# EasyEDA Pro project 3-phase-bldcdriver.eprj

# Schematic 3-phase-bldcdriver
Create Date: 2024-08-07; Page Name: P1; Project Name: 3-phase-bldcdriver; Schematic Name: 3-phase-bldcdriver; Update Date: 2024-08-07; Company: EasyEDA.com; Drawn: EasyEDA; Page Size: A4; Part Number: JLCPCB-002; Reviewed: EasyEDA; Version: V0.1
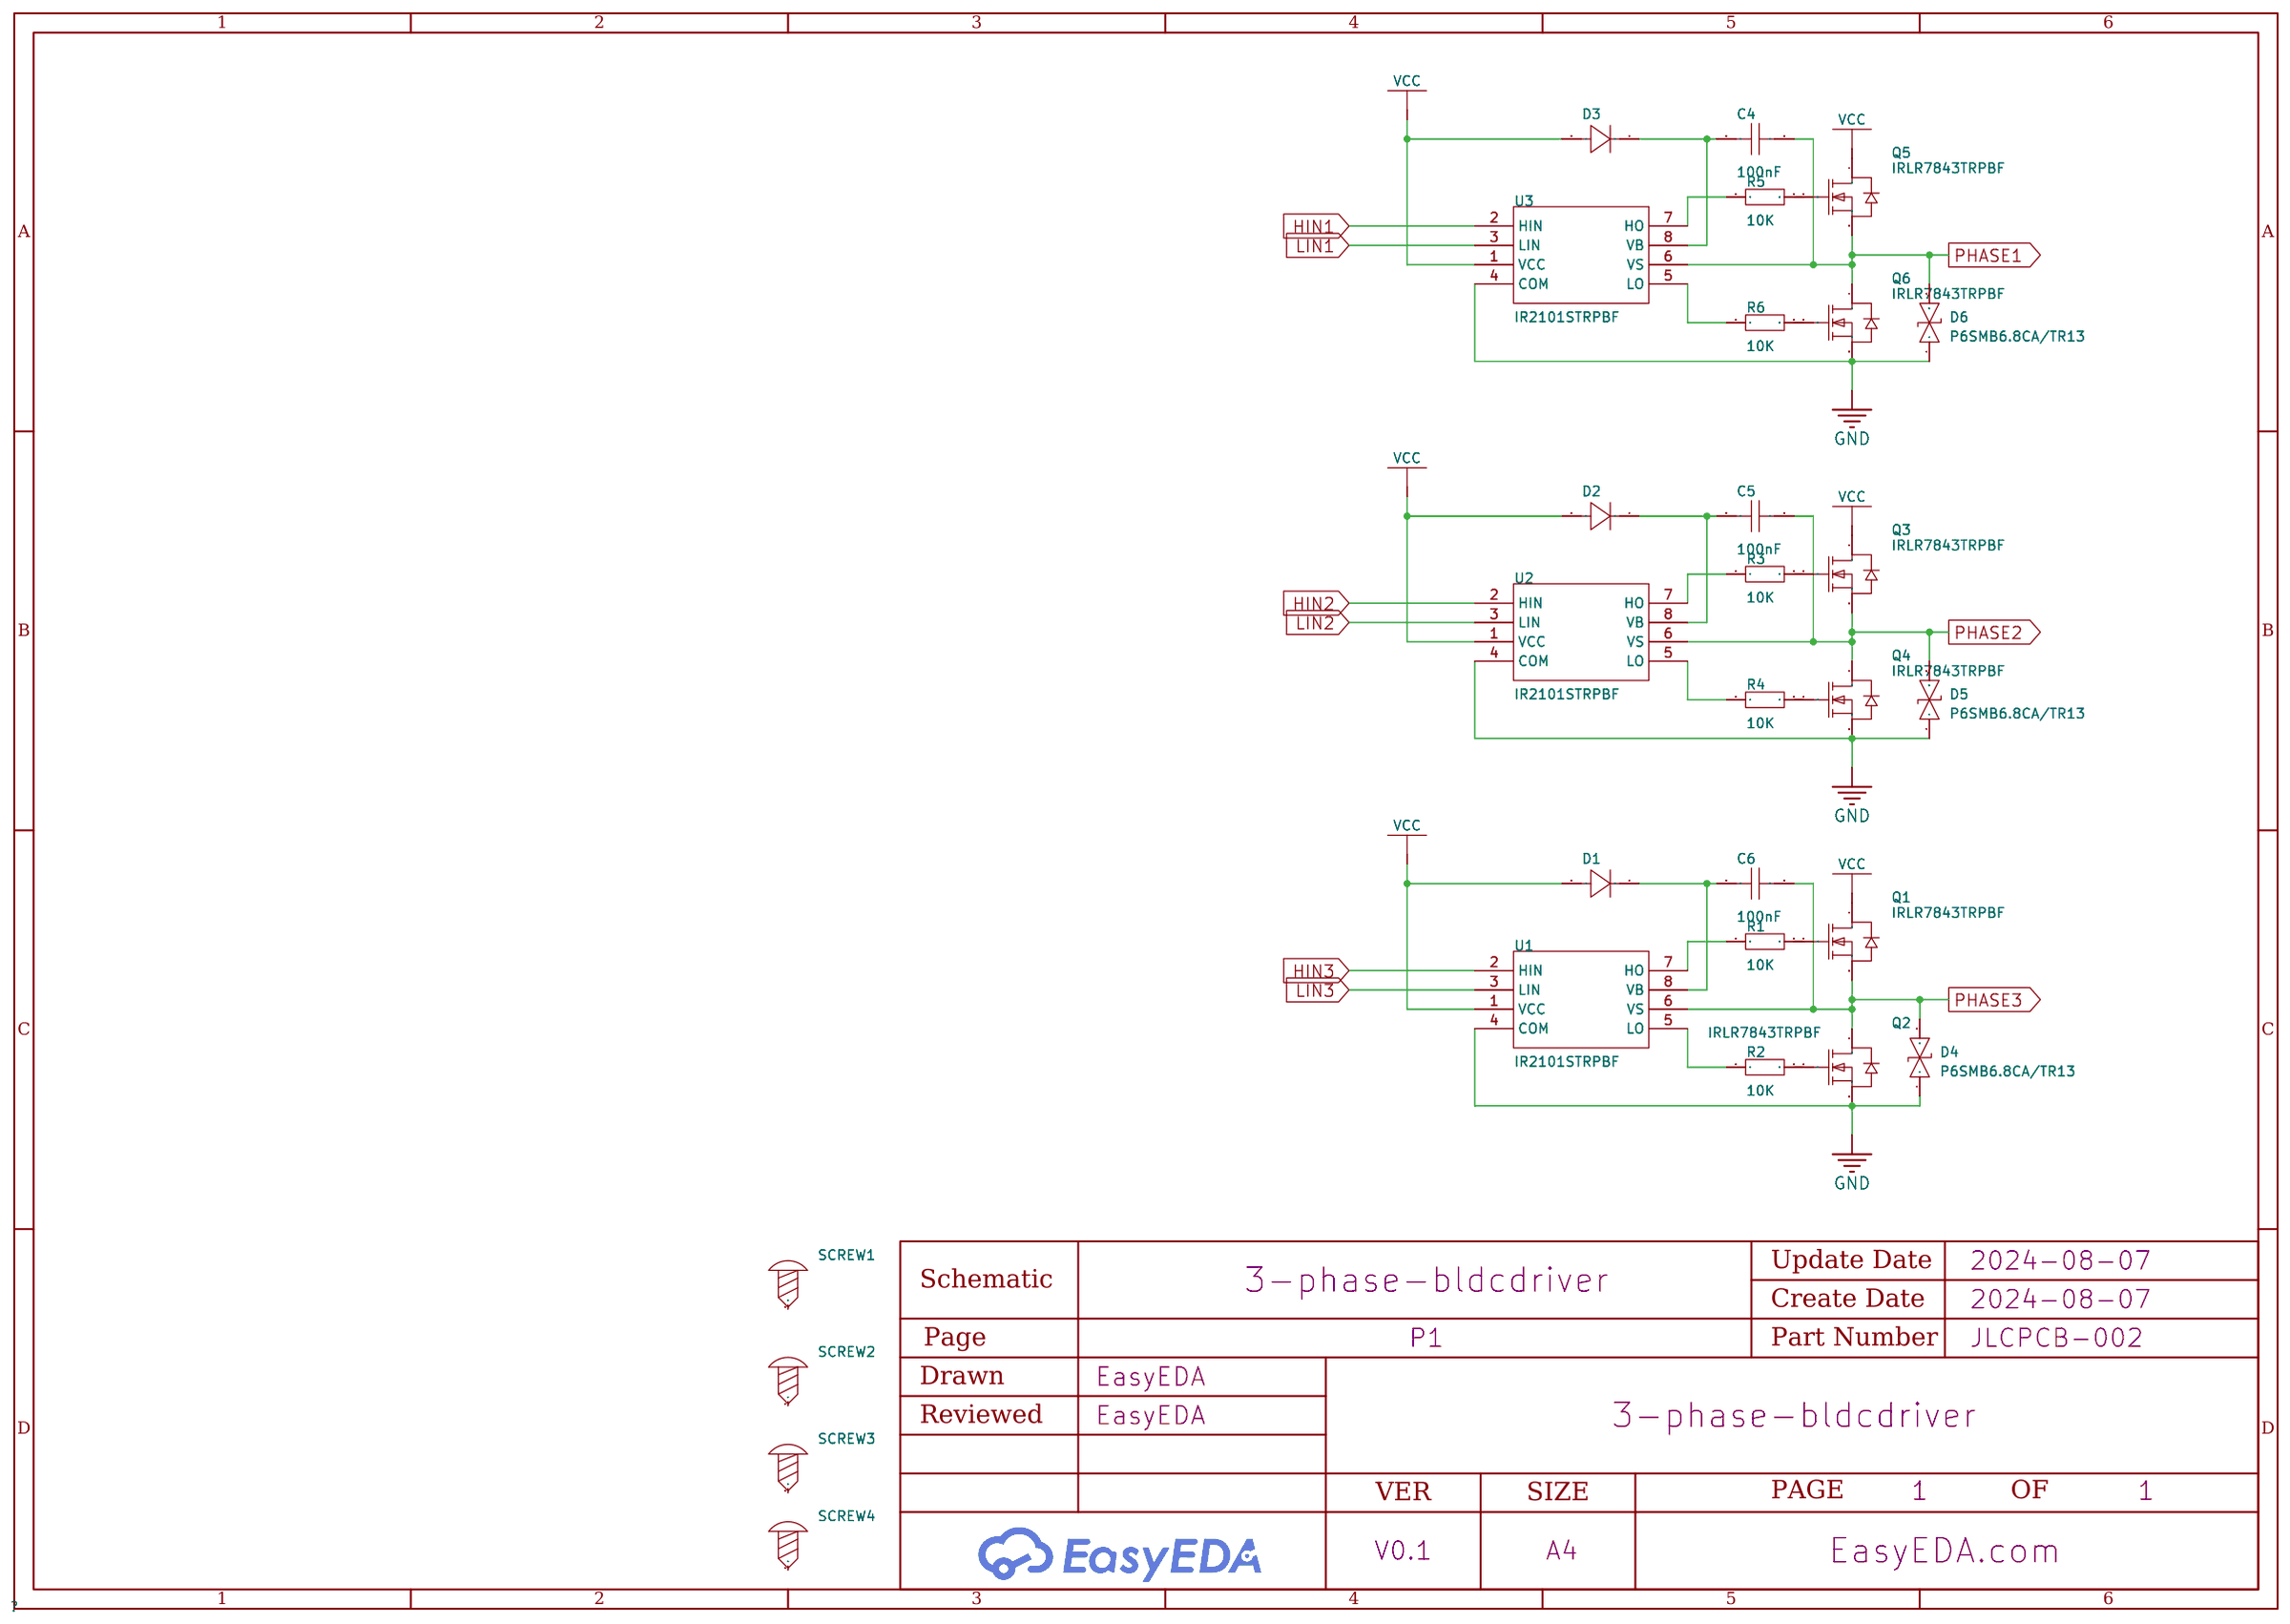
[diagram p0: schematic sheet]

## Parts
C4  100nF  [C0603]
C5  100nF  [C0603]
C6  100nF  [C0603]
D1  -  [DO-41_BD2.4-L4.7-P8.70-D0.9-RD]
D2  -  [DO-41_BD2.4-L4.7-P8.70-D0.9-RD]
D3  -  [DO-41_BD2.4-L4.7-P8.70-D0.9-RD]
D4  P6SMB6.8CA/TR13  [SMB_L4.6-W3.6-LS5.3-BI]
D5  P6SMB6.8CA/TR13  [SMB_L4.6-W3.6-LS5.3-BI]
D6  P6SMB6.8CA/TR13  [SMB_L4.6-W3.6-LS5.3-BI]
Q1  IRLR7843TRPBF  [TO-252-2_L6.5-W6.1-P4.58-LS10.0-TR]
Q2  IRLR7843TRPBF  [TO-252-2_L6.5-W6.1-P4.58-LS10.0-TR]
Q3  IRLR7843TRPBF  [TO-252-2_L6.5-W6.1-P4.58-LS10.0-TR]
Q4  IRLR7843TRPBF  [TO-252-2_L6.5-W6.1-P4.58-LS10.0-TR]
Q5  IRLR7843TRPBF  [TO-252-2_L6.5-W6.1-P4.58-LS10.0-TR]
Q6  IRLR7843TRPBF  [TO-252-2_L6.5-W6.1-P4.58-LS10.0-TR]
R1  10K  [R0603]
R2  10K  [R0603]
R3  10K  [R0603]
R4  10K  [R0603]
R5  10K  [R0603]
R6  10K  [R0603]
SCREW1  -  [Screw-Hole-M2]
SCREW2  -  [Screw-Hole-M2]
SCREW3  -  [Screw-Hole-M2]
SCREW4  -  [Screw-Hole-M2]
U1  IR2101STRPBF  [SOIC-8_L5.0-W4.0-P1.27-LS6.0-BL]
U2  IR2101STRPBF  [SOIC-8_L5.0-W4.0-P1.27-LS6.0-BL]
U3  IR2101STRPBF  [SOIC-8_L5.0-W4.0-P1.27-LS6.0-BL]

## Library data of the parts
C4-C6 = CAP_0603: Supplier Footprint: 0603
D1-D3 = 1N4007: Supplier Footprint: DO-41
D4-D6 = P6SMB6.8CA/TR13: Reverse Stand-Off Voltage (Vrwm):5.8V Maximum Clamping Voltage:10.5V Peak Pulse Current (Ipp)@10/1000us:58.1A Peak Pulse Power Dissipation (Ppp)@10/1000us:600W Breakdown Voltage:6.45V Type:TVS; Supplier Part: C78395; Manufacturer: Brightking(君耀电子); Supplier Footprint: SMB(DO-214AA); JLCPCB Part Class: Basic Part; Datasheet: https://atta.szlcsc.com/upload/public/pdf/source/20160709/1468031879762.pdf; Supplier: LCSC; Reverse Stand-Off Voltage (Vrwm): 5.8V; Maximum Clamping Voltage: 10.5V; Peak Pulse Current (Ipp)@10/1000us: 58.1A; Peak Pulse Power Dissipation (Ppp)@10/1000us: 600W; Breakdown Voltage: 6.45V; Type: TVS
Q1-Q6 = IRLR7843TRPBF_C21988: Type:1个NChannel Drain Source Voltage (Vdss): Continuous Drain Current (Id): Power Dissipation (Pd): Drain Source On Resistance (RDS(on)@Vgs,Id):3.3mΩ@10V,15A Gate Threshold Voltage (Vgs(th)@Id):2.3V@250uA Total Gate Charge (Qg@Vgs):50nC@4.5V Input Capacit; LCSC Part Name: 1个N沟道 耐压:30V 电流:161A; Supplier Part: C21988; Manufacturer: Infineon(英飞凌); Supplier Footprint: TO-252-2(DPAK); JLCPCB Part Class: Extended Part; Datasheet: https://atta.szlcsc.com/upload/public/pdf/source/20140314/1457707013919.pdf; Supplier: LCSC; Type: 1个NChannel; Drain Source On Resistance (RDS(on)@Vgs,Id): 3.3mΩ@10V,15A; Gate Threshold Voltage (Vgs(th)@Id): 2.3V@250uA; Total Gate Charge (Qg@Vgs): 50nC@4.5V; Input Capacitance (Ciss@Vds): 4.38nF@15V; Operating Temperature: -55℃~+175℃@(Tj)
R1-R6 = Res_0603: Supplier Footprint: 0603
SCREW1-SCREW4 = Screw-Hole-M2: Supplier Footprint: 插件
U1-U3 = IR2101STRPBF: Driven Configuration:Half Bridge Load Type:MOSFET；IGBT Number of Drivers:2 Peak Output Current(sink):360mA Peak Output Current(source):210mA Supply Voltage:10V~20V Supply Voltage:10V~20V Rise Time:100ns Fall Time:50ns Operating Temperature:-40℃~+150℃@(Tj); Supplier Part: C2956; Manufacturer: Infineon(英飞凌); Supplier Footprint: SOIC-8; JLCPCB Part Class: Extended Part; Datasheet: https://atta.szlcsc.com/upload/public/pdf/source/20180112/C152687_15157257779631261587.pdf; Supplier: LCSC; Driven Configuration: Half Bridge; Load Type: MOSFET；IGBT; Number of Drivers: 2; Peak Output Current(sink): 360mA; Peak Output Current(source): 210mA; Supply Voltage: 10V~20V; Rise Time: 100ns; Fall Time: 50ns; Operating Temperature: -40℃~+150℃@(Tj)

## Nets
GND: D4.1 D5.1 D6.1 Q2.3(S) Q4.3(S) Q6.3(S) U1.4(COM) U2.4(COM) U3.4(COM)
VCC: D1.2(A) D2.2(A) D3.2(A) Q1.4(D) Q3.4(D) Q5.4(D) U1.1(VCC) U2.1(VCC) U3.1(VCC)
HIN1: U3.2(HIN)
HIN2: U2.2(HIN)
HIN3: U1.2(HIN)
LIN1: U3.3(LIN)
LIN2: U2.3(LIN)
LIN3: U1.3(LIN)
PHASE1: C4.1 D6.2 Q5.3(S) Q6.4(D) U3.6(VS)
PHASE2: C5.1 D5.2 Q3.3(S) Q4.4(D) U2.6(VS)
PHASE3: C6.1 D4.2 Q1.3(S) Q2.4(D) U1.6(VS)
$1N648: Q2.1(G) R2.2
$1N650: Q1.1(G) R1.2
$1N652: R1.1 U1.7(HO)
$1N655: R2.1 U1.5(LO)
$1N669: C6.2 D1.1(K) U1.8(VB)
$1N980: Q4.1(G) R4.2
$1N982: Q3.1(G) R3.2
$1N984: R3.1 U2.7(HO)
$1N987: R4.1 U2.5(LO)
$1N1001: C5.2 D2.1(K) U2.8(VB)
$1N1312: Q6.1(G) R6.2
$1N1314: Q5.1(G) R5.2
$1N1316: R5.1 U3.7(HO)
$1N1319: R6.1 U3.5(LO)
$1N1333: C4.2 D3.1(K) U3.8(VB)

Not connected (* = marked no-connect by the designer): SCREW1 1; SCREW2 1; SCREW3 1; SCREW4 1

# Schematic Schematic1
Create Date: 2024-08-07; Page Name: P1; Project Name: 3-phase-bldcdriver; Schematic Name: Schematic1; Update Date: 2024-08-07; Company: EasyEDA.com; Drawn: EasyEDA; Page Size: A4; Part Number: JLCPCB-002; Reviewed: EasyEDA; Version: V0.1
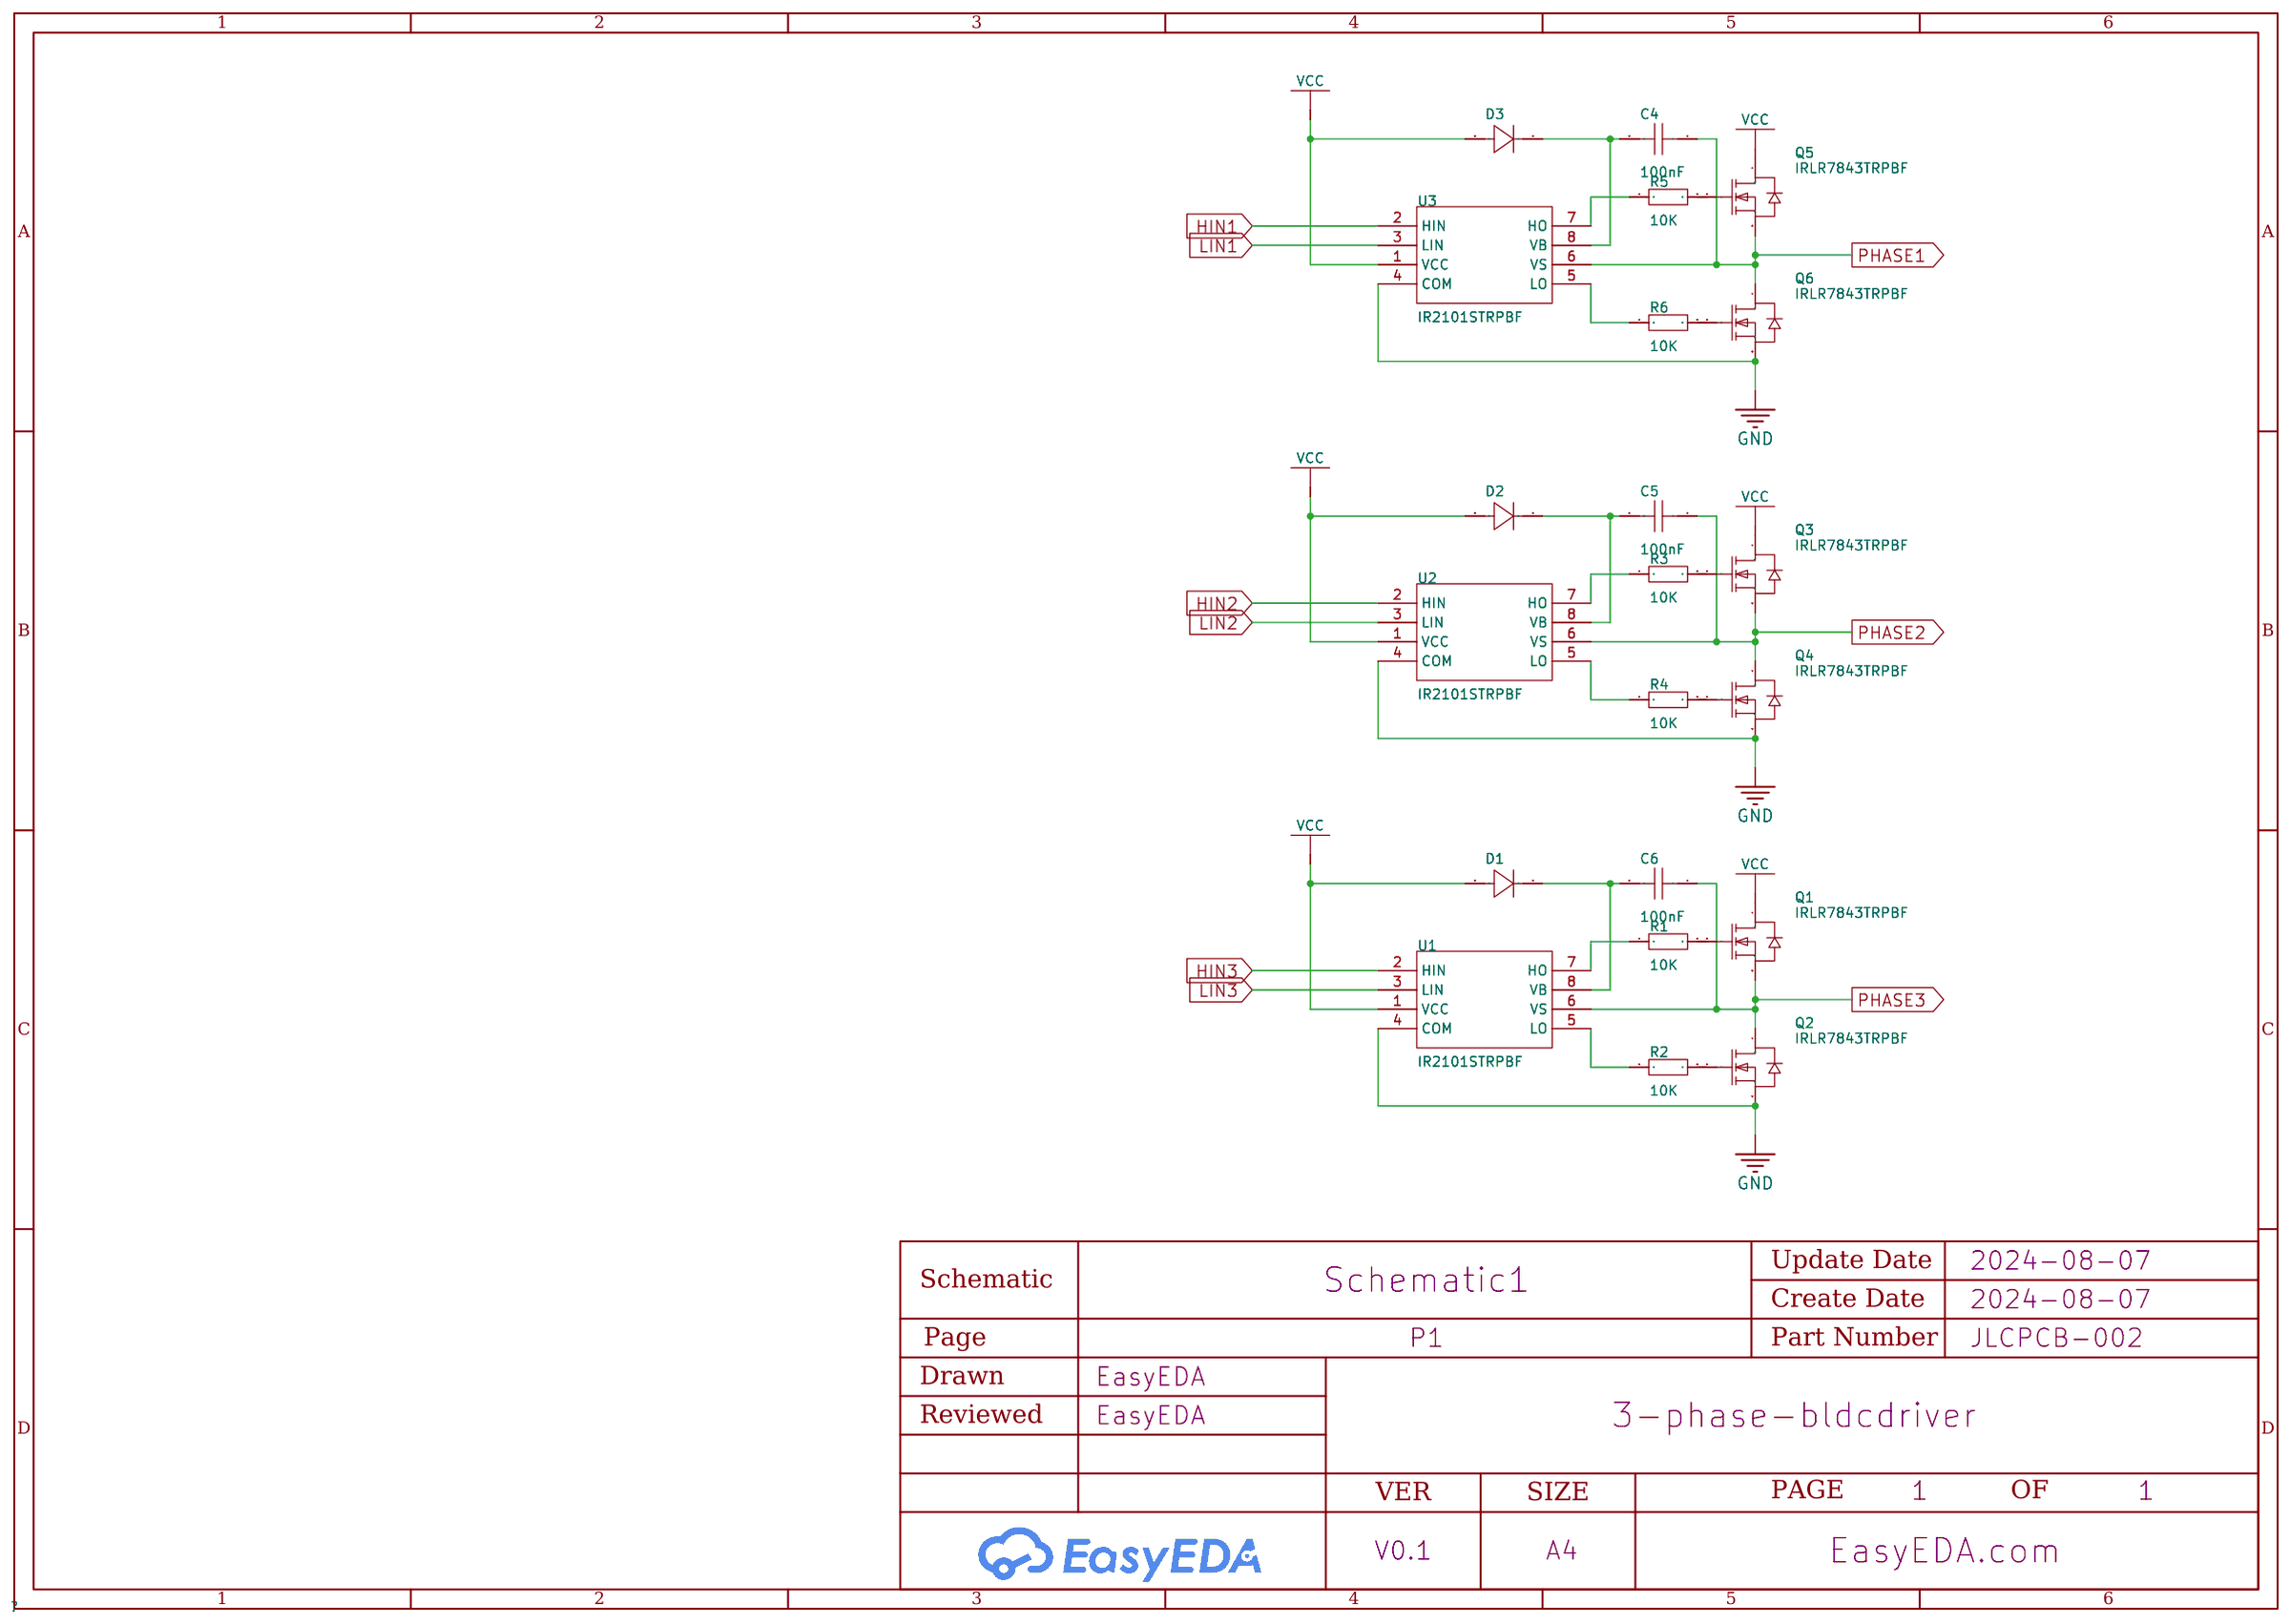
[diagram p1: schematic sheet]

## Parts
C4  100nF  [C0603]
C5  100nF  [C0603]
C6  100nF  [C0603]
D1  -  [DO-41_BD2.4-L4.7-P8.70-D0.9-RD]
D2  -  [DO-41_BD2.4-L4.7-P8.70-D0.9-RD]
D3  -  [DO-41_BD2.4-L4.7-P8.70-D0.9-RD]
Q1  IRLR7843TRPBF  [TO-252-2_L6.5-W6.1-P4.58-LS10.0-TR]
Q2  IRLR7843TRPBF  [TO-252-2_L6.5-W6.1-P4.58-LS10.0-TR]
Q3  IRLR7843TRPBF  [TO-252-2_L6.5-W6.1-P4.58-LS10.0-TR]
Q4  IRLR7843TRPBF  [TO-252-2_L6.5-W6.1-P4.58-LS10.0-TR]
Q5  IRLR7843TRPBF  [TO-252-2_L6.5-W6.1-P4.58-LS10.0-TR]
Q6  IRLR7843TRPBF  [TO-252-2_L6.5-W6.1-P4.58-LS10.0-TR]
R1  10K  [R0603]
R2  10K  [R0603]
R3  10K  [R0603]
R4  10K  [R0603]
R5  10K  [R0603]
R6  10K  [R0603]
U1  IR2101STRPBF  [SOIC-8_L5.0-W4.0-P1.27-LS6.0-BL]
U2  IR2101STRPBF  [SOIC-8_L5.0-W4.0-P1.27-LS6.0-BL]
U3  IR2101STRPBF  [SOIC-8_L5.0-W4.0-P1.27-LS6.0-BL]

## Library data of the parts
C4-C6 = CAP_0603: Supplier Footprint: 0603
D1-D3 = 1N4007: Supplier Footprint: DO-41
Q1-Q6 = IRLR7843TRPBF_C21988: Type:1个NChannel Drain Source Voltage (Vdss): Continuous Drain Current (Id): Power Dissipation (Pd): Drain Source On Resistance (RDS(on)@Vgs,Id):3.3mΩ@10V,15A Gate Threshold Voltage (Vgs(th)@Id):2.3V@250uA Total Gate Charge (Qg@Vgs):50nC@4.5V Input Capacit; LCSC Part Name: 1个N沟道 耐压:30V 电流:161A; Supplier Part: C21988; Manufacturer: Infineon(英飞凌); Supplier Footprint: TO-252-2(DPAK); JLCPCB Part Class: Extended Part; Datasheet: https://atta.szlcsc.com/upload/public/pdf/source/20140314/1457707013919.pdf; Supplier: LCSC; Type: 1个NChannel; Drain Source On Resistance (RDS(on)@Vgs,Id): 3.3mΩ@10V,15A; Gate Threshold Voltage (Vgs(th)@Id): 2.3V@250uA; Total Gate Charge (Qg@Vgs): 50nC@4.5V; Input Capacitance (Ciss@Vds): 4.38nF@15V; Operating Temperature: -55℃~+175℃@(Tj)
R1-R6 = Res_0603: Supplier Footprint: 0603
U1-U3 = IR2101STRPBF: Driven Configuration:Half Bridge Load Type:MOSFET；IGBT Number of Drivers:2 Peak Output Current(sink):360mA Peak Output Current(source):210mA Supply Voltage:10V~20V Supply Voltage:10V~20V Rise Time:100ns Fall Time:50ns Operating Temperature:-40℃~+150℃@(Tj); Supplier Part: C2956; Manufacturer: Infineon(英飞凌); Supplier Footprint: SOIC-8; JLCPCB Part Class: Extended Part; Datasheet: https://atta.szlcsc.com/upload/public/pdf/source/20180112/C152687_15157257779631261587.pdf; Supplier: LCSC; Driven Configuration: Half Bridge; Load Type: MOSFET；IGBT; Number of Drivers: 2; Peak Output Current(sink): 360mA; Peak Output Current(source): 210mA; Supply Voltage: 10V~20V; Rise Time: 100ns; Fall Time: 50ns; Operating Temperature: -40℃~+150℃@(Tj)

## Nets
GND: Q2.3(S) Q4.3(S) Q6.3(S) U1.4(COM) U2.4(COM) U3.4(COM)
VCC: D1.2(A) D2.2(A) D3.2(A) Q1.4(D) Q3.4(D) Q5.4(D) U1.1(VCC) U2.1(VCC) U3.1(VCC)
HIN1: U3.2(HIN)
HIN2: U2.2(HIN)
HIN3: U1.2(HIN)
LIN1: U3.3(LIN)
LIN2: U2.3(LIN)
LIN3: U1.3(LIN)
PHASE1: C4.1 Q5.3(S) Q6.4(D) U3.6(VS)
PHASE2: C5.1 Q3.3(S) Q4.4(D) U2.6(VS)
PHASE3: C6.1 Q1.3(S) Q2.4(D) U1.6(VS)
Net-(C4-2): C4.2 D3.1(K) U3.8(VB)
Net-(C5-2): C5.2 D2.1(K) U2.8(VB)
Net-(C6-2): C6.2 D1.1(K) U1.8(VB)
Net-(Q1-1): Q1.1(G) R1.2
Net-(Q2-1): Q2.1(G) R2.2
Net-(Q3-1): Q3.1(G) R3.2
Net-(Q4-1): Q4.1(G) R4.2
Net-(Q5-1): Q5.1(G) R5.2
Net-(Q6-1): Q6.1(G) R6.2
Net-(R1-1): R1.1 U1.7(HO)
Net-(R2-1): R2.1 U1.5(LO)
Net-(R3-1): R3.1 U2.7(HO)
Net-(R4-1): R4.1 U2.5(LO)
Net-(R5-1): R5.1 U3.7(HO)
Net-(R6-1): R6.1 U3.5(LO)

# Board 3-phase-bldcdriver
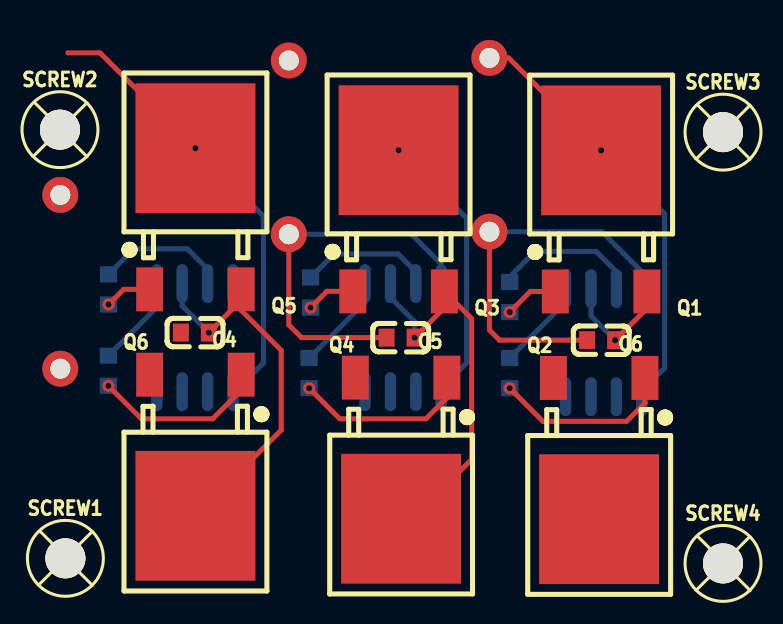
[diagram p2: board, top side]
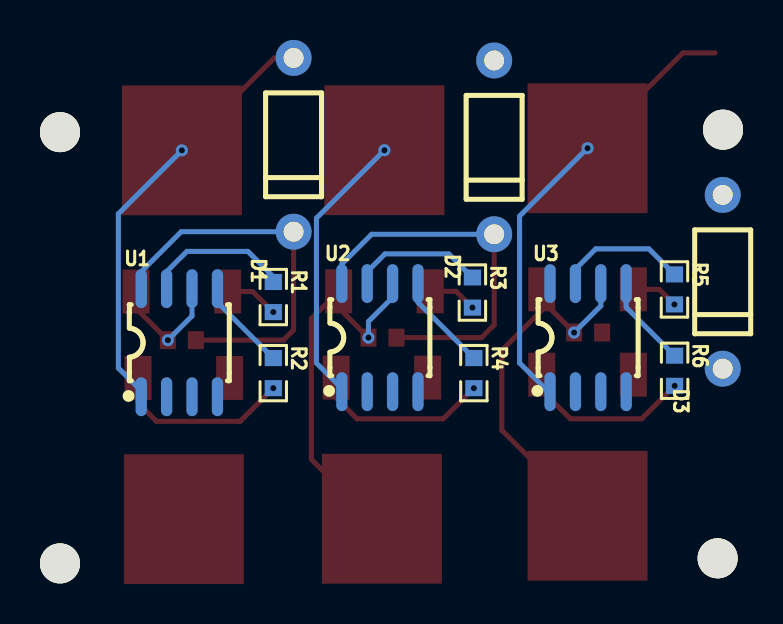
[diagram p3: board, bottom side, seen from below]

No outline. copper layers: Top Layer, Inner1, Inner2, Bottom Layer. Coordinates in mm from the lowest, leftmost part position.
Stack: Top Layer 0.035mm 外层铜厚1oz / Dielectric1 0.2104mm 7628 RC49% 8.6mil / Inner1 0.0152mm 内层铜厚 / Dielectric2 1.065mm 1.1mm H/HOZ 含铜 / Inner2 0.0152mm 内层铜厚 / Dielectric3 0.2104mm 7628 RC49% 8.6mil / Bottom Layer 0.035mm 外层铜厚1oz

## Design rules (mm)
template: JLCPCB Capability(Two Layers Board)
spacing copperThickness1oz (default): track to track 0.102, other pairs 0.152 to 0.3
spacing copperThickness2oz: track to track 0.203, other pairs 0.152 to 0.3
track width copperThickness1oz (default): min 0.127, default 0.254, max 2.54
track width copperThickness2oz: min 0.203, default 0.254, max 2.54
differential pair differentialPair (default): width min 0.127, default 0.254, max 2.54; gap min 0.152, default 0.152
via viaSize (default): diameter min 0.5, default 0.61, max 10; hole min 0.3, default 0.305, max 6.3

## Placement (name value [footprint] x y rotation side)
C4  100nF  [C0603]  6.75 11.56 180 top
C5  100nF  [C0603]  17.03 11.3 180 top
C6  100nF  [C0603]  27.07 11.18 180 top
D1  -  [DO-41_BD2.4-L4.7-P8.70-D0.9-RD]  21.48 20.96 90 bottom
D2  -  [DO-41_BD2.4-L4.7-P8.70-D0.9-RD]  11.45 20.83 90 bottom
D3  -  [DO-41_BD2.4-L4.7-P8.70-D0.9-RD]  0.02 14.1 90 bottom
Q1  IRLR7843TRPBF  [TO-252-2_L6.5-W6.1-P4.58-LS10.0-TR]  27.07 17.15 180 top
Q2  IRLR7843TRPBF  [TO-252-2_L6.5-W6.1-P4.58-LS10.0-TR]  26.97 5.75 0 top
Q3  IRLR7843TRPBF  [TO-252-2_L6.5-W6.1-P4.58-LS10.0-TR]  16.94 17.15 180 top
Q4  IRLR7843TRPBF  [TO-252-2_L6.5-W6.1-P4.58-LS10.0-TR]  17.06 5.77 0 top
Q5  IRLR7843TRPBF  [TO-252-2_L6.5-W6.1-P4.58-LS10.0-TR]  6.78 17.25 180 top
Q6  IRLR7843TRPBF  [TO-252-2_L6.5-W6.1-P4.58-LS10.0-TR]  6.78 5.92 0 top
R1  10K  [R0603]  22.5 13.34 270 bottom
R2  10K  [R0603]  22.5 9.53 270 bottom
R3  10K  [R0603]  12.54 13.56 270 bottom
R4  10K  [R0603]  12.46 9.53 270 bottom
R5  10K  [R0603]  2.43 13.72 270 bottom
R6  10K  [R0603]  2.42 9.64 270 bottom
SCREW1  -  [Screw-Hole-M2]  0.27 0.25 0 top
SCREW2  -  [Screw-Hole-M2]  0 21.71 0 top
SCREW3  -  [Screw-Hole-M2]  33.16 21.59 0 top
SCREW4  -  [Screw-Hole-M2]  33.16 0 0 top
U1  IR2101STRPBF  [SOIC-8_L5.0-W4.0-P1.27-LS6.0-BL]  27.19 11.05 180 bottom
U2  IR2101STRPBF  [SOIC-8_L5.0-W4.0-P1.27-LS6.0-BL]  17.16 11.3 180 bottom
U3  IR2101STRPBF  [SOIC-8_L5.0-W4.0-P1.27-LS6.0-BL]  6.75 11.3 180 bottom

## Footprints (pads in the part's own frame, mm; a bottom-side part is the same pattern mirrored in y, then rotated)
C0603
  rect 0.8x0.9 smd: 1(-0.7,0) 2(0.7,0)
DO-41_BD2.4-L4.7-P8.70-D0.9-RD
  round 1.8 hole 1: 1(-4.35,0) 2(4.35,0)
R0603
  rect 0.806x0.864 smd: 1(-0.753,0) 2(0.753,0)
Screw-Hole-M2
  round 2 hole 2: 1(0,0)
SOIC-8_L5.0-W4.0-P1.27-LS6.0-BL
  oval 0.569x1.95 smd: 1(-1.905,-2.705) 2(-0.635,-2.705) 3(0.635,-2.705) 4(1.905,-2.705) 5(1.905,2.705) 6(0.635,2.705) 7(-0.635,2.705) 8(-1.905,2.705)
TO-252-2_L6.5-W6.1-P4.58-LS10.0-TR
  rect 1.35x2.2 smd: 1(2.29,3.533) 3(-2.29,3.533)
  rect 6x6.5 smd: 4(0,-3.533)

## Nets
As in the schematic.

Pads without a net: SCREW1 1; SCREW2 1; SCREW3 1; SCREW4 1

## Via types
v1: diameter 0.61, hole 0.305, Top Layer to Bottom Layer, 12 vias

## Routing (per net, layer and track width the routed paths; a pad name or vN(x,y) marks a point on that pad's centre or on a via; arc(x,y) is an arc through that point)
VCC: length 58.3
  Top Layer w0.254: D1.2 22.44,25.31 v1(27.07,20.68) ; 0.4,25.56 2,25.56 v1(6.78,20.79)
  Bottom Layer w0.254: v1(6.78,20.79) 10.18,17.39 10.18,10.03 8.74,8.6 U3.1 ; U1.1 29.1,8.64 30.24,9.78 30.24,17.5 v1(27.07,20.68) ; U2.1 19.07,8.76 20.34,10.03 20.34,17.29 v1(16.94,20.69)
PHASE1: length 19.2
  Top Layer w0.254: Q6.4 11.06,6.67 11.06,10.67 9.07,12.67 9.07,13.18 ; v1(7.45,11.56) 9.07,13.18 ; 9.07,13.18 Q5.3
  Bottom Layer w0.254: U3.6 6.11,12.89 v1(7.45,11.56)
PHASE2: length 19.9
  Top Layer w0.254: v1(17.73,11.3) 19.23,12.8 Q3.3 20.59,12.25 20.59,5.21 17.62,2.24 Q4.4
  Bottom Layer w0.254: v1(17.73,11.3) 17.73,12.11 16.53,13.32 U2.6
PHASE3: length 6.2
  Top Layer w0.254: Q1.3 29.36,12.77 v1(27.77,11.18)
  Bottom Layer w0.254: U1.6 26.56,12.38 v1(27.77,11.18)
$1N648: length 9.1
  Top Layer w0.254: 29.26,9.28 29.26,8.03 28.34,7.11 24.15,7.11 v1(22.5,8.77)
$1N650: length 2.7
  Top Layer w0.254: Q1.1 23.53,13.61 v1(22.5,12.58)
$1N652: length 7.4
  Bottom Layer w0.254: U1.7 27.83,14.61 26.81,15.62 23.77,15.62 22.5,14.35 R1.1
$1N655: length 4.6
  Bottom Layer w0.254: U1.5 25.29,13.07 R2.1
$1N669: length 19.3
  Top Layer w0.254: D1.1 21.48,11.68 21.99,11.18 C6.2
  Bottom Layer w0.254: U1.8 29.1,14.61 27.1,16.61 D1.1
$1N980: length 9
  Top Layer w0.254: v1(12.46,8.77) 13.99,7.24 18.3,7.24 19.35,8.29 Q4.1
$1N982: length 2.4
  Top Layer w0.254: Q3.1 13.35,13.62 v1(12.54,12.81)
$1N984: length 6.7
  Bottom Layer w0.254: R3.1 13.72,15.49 16.91,15.49 17.8,14.61 U2.7
$1N987: length 4.9
  Bottom Layer w0.254: R4.1 15.26,13.07 U2.5
$1N1001: length 18.9
  Top Layer w0.254: C5.2 12.08,11.3 11.45,11.94 D2.1
  Bottom Layer w0.254: D2.1 17.57,16.48 19.07,14.99 U2.8
$1N1312: length 8.7
  Top Layer w0.254: Q6.1 9.07,8.67 7.64,7.24 4.07,7.24 v1(2.42,8.89)
$1N1314: length 2.4
  Top Layer w0.254: Q5.1 3.19,13.72 v1(2.43,12.96)
$1N1316: length 6.6
  Bottom Layer w0.254: U3.7 7.38,14.73 6.37,15.75 3.71,15.75 R5.1
$1N1319: length 4.6
  Bottom Layer w0.254: 2.42,10.4 4.84,12.82 U3.5
